# EAGLE design SparkFun_Si7021_Breakout (EAGLE 7.2.0)
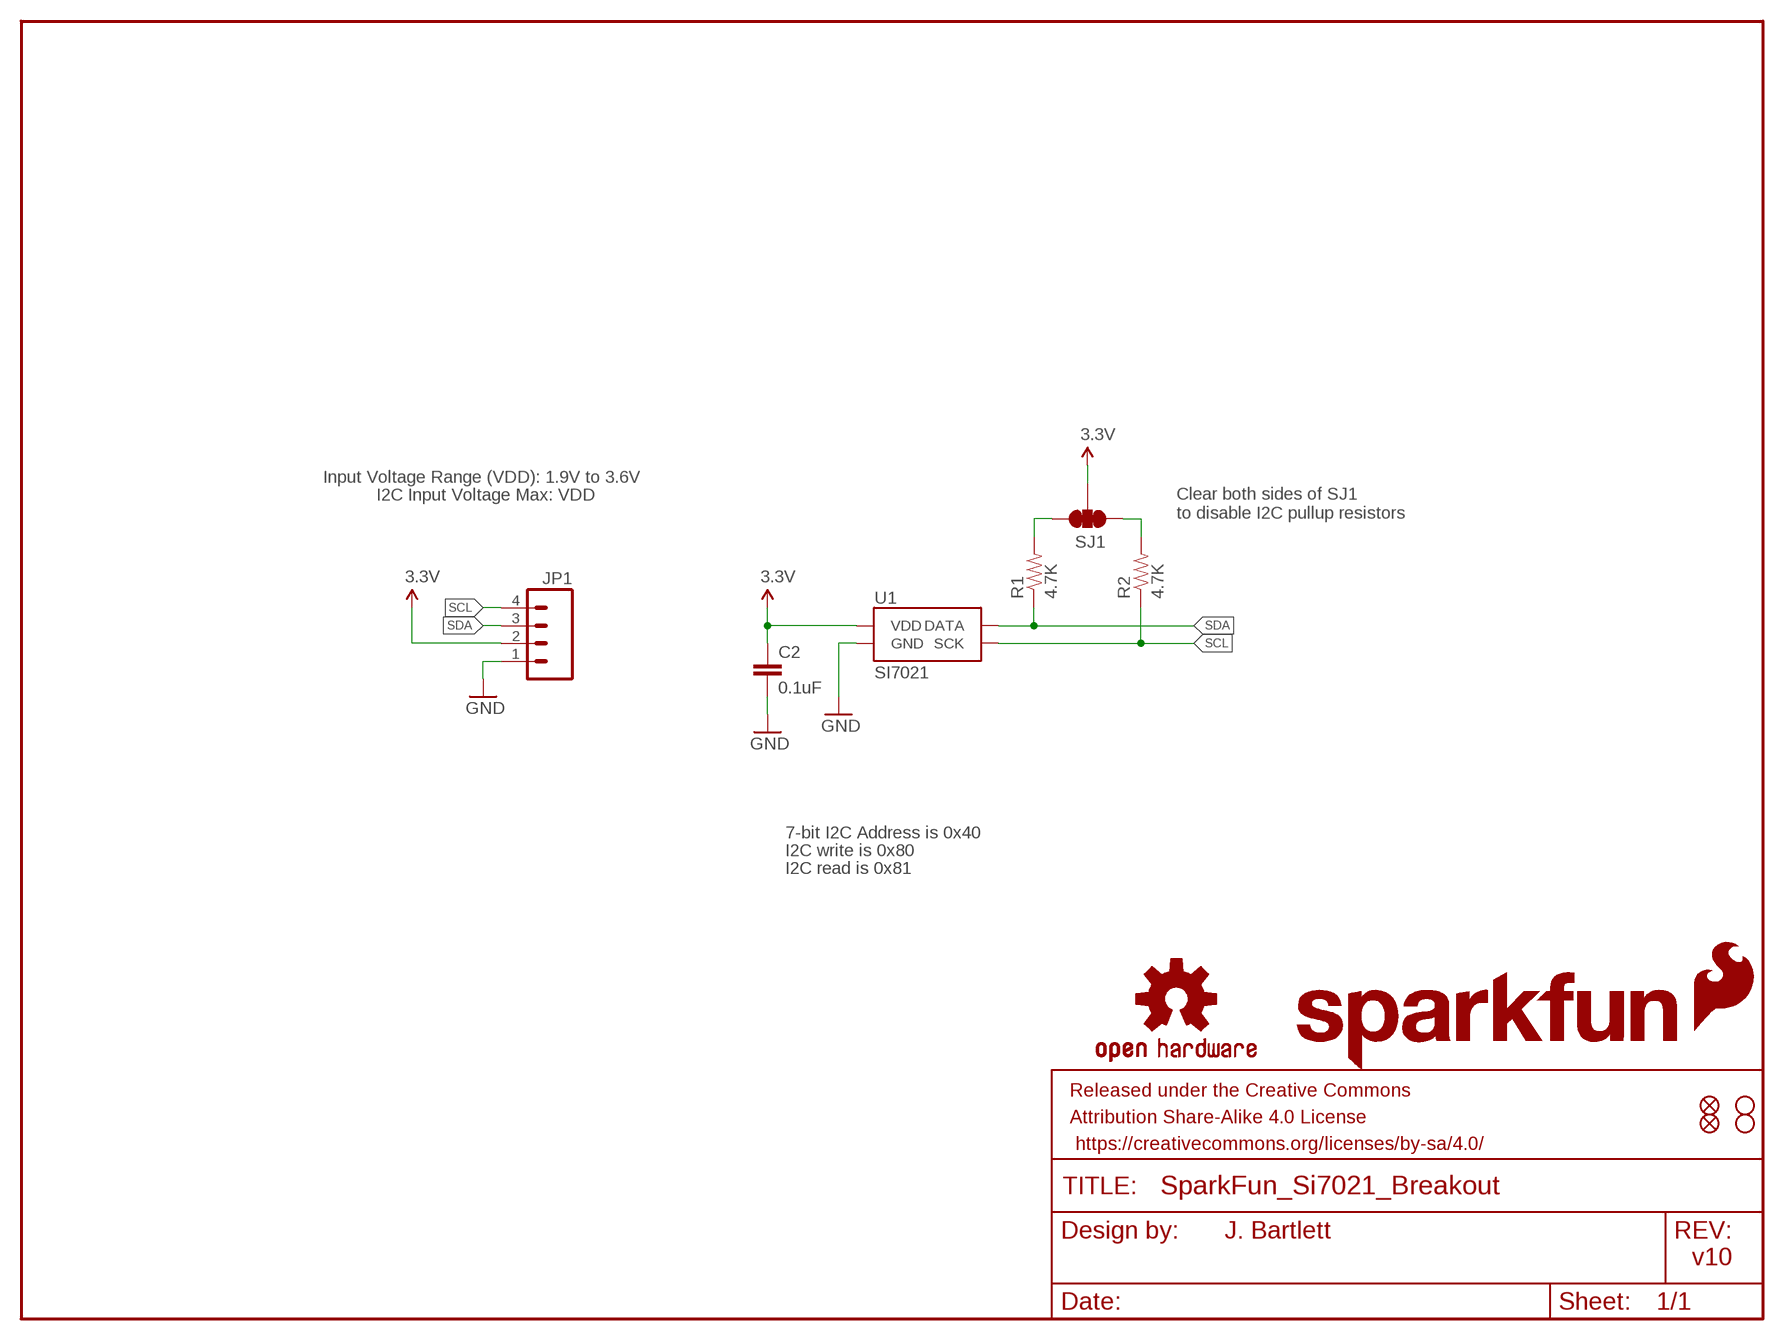
[diagram p0: schematic, sheet 1]

## Parts
C2  0.1uF  0.1UF-25V(+80/-20%)(0603)  [0603-CAP]
FRAME2  FRAME-LETTER  [CREATIVE_COMMONS]
JP1  M04PTH  [1X04]
JP3  FIDUCIALUFIDUCIAL  [MICRO-FIDUCIAL]
JP4  FIDUCIALUFIDUCIAL  [MICRO-FIDUCIAL]
LOGO2  OSHW-LOGOS  [OSHW-LOGO-S]
LOGO3  SFE_LOGO_FLAME.1_INCH  [SFE_LOGO_FLAME_.1]
LOGO4  SFE_LOGO_NAME.1_INCH  [SFE_LOGO_NAME_.1]
R1  4.7K  4.7KOHM-1/10W-1%(0603)  [0603-RES]
R2  4.7K  4.7KOHM-1/10W-1%(0603)  [0603-RES]
SJ1  SOLDERJUMPER_2WAYPASTE1&2&3  [SJ_3_PASTE1&2&3]
STANDOFF1  STAND-OFF  [STAND-OFF]
STANDOFF2  STAND-OFF  [STAND-OFF]
U1  SI7021  [SI7021]

## Nets
3.3V: C2.1 JP1.2 SJ1.2 U1.VDD
GND: C2.2 JP1.1 U1.GND
N$1: R1.2 SJ1.3
N$2: R2.2 SJ1.1
SCL: JP1.4 R2.1 U1.SCK
SDA: JP1.3 R1.1 U1.DATA

## Notes on the sheet
- Input Voltage Range (VDD): 1.9V to 3.6V
- I2C Input Voltage Max: VDD
- Clear both sides of SJ1
  to disable I2C pullup resistors
- 7-bit I2C Address is 0x40
- I2C write is 0x80
- I2C read is 0x81
- J. Bartlett
- v10

## Library data of the parts
C2 = SparkFun-Capacitors:0.1UF-25V(+80/-20%)(0603): CAP-00810 Ceramic Standard decoupling cap; PROD_ID: CAP-00810
FRAME2 = SparkFun-Aesthetics:FRAME-LETTER: Schematic Frame Standard 8.5x11 US Letter frame
JP1 = SparkFun-Connectors:M04: Header 4 Standard 4-pin 0.1" header. Use with straight break away headers (SKU : PRT-00116), right angle break away headers (PRT-00553), swiss pins (PRT-00743), machine pins (PRT-00117), and female headers (PRT-00115). Molex polarized connector foot print use with SKU : PRT-08231 with associated crimp pins and housings. 1MM SMD Version SKU: PRT-10208
JP3 JP4 = SparkFun-Aesthetics:FIDUCIAL: Fiducial Alignment Points Various fiducial points for machine vision alignment.
LOGO2 = SparkFun-Aesthetics:OSHW-LOGO: Open Source Hardware Logo This logo indicates the piece of hardware it is found on incorporates a OSHW license and/or adheres to the definition of open source hardware found here: http://freedomdefined.org/OSHW
LOGO3 = SparkFun-Aesthetics:SFE_LOGO_FLAME: SFE Logo, flame only This is the SparkFun flame logo. The logo on the schematic will always be the same size; the package variant is the height of the flame. Default layer for the logo on the board is tSilk.
LOGO4 = SparkFun-Aesthetics:SFE_LOGO_NAME: SFE Logo, name only This is the SparkFun name logo. The logo on the schematic will always be the same size; the package variant is the height of the flame part of the logo (or the height the flame would be, if it were drawn). Default layer for the logo on the board is tSilk.
R1 R2 = SparkFun-Resistors:4.7KOHM-1/10W-1%(0603): RES-07857; PROD_ID: RES-07857
SJ1 = mike-temp:SOLDERJUMPER_2WAY: Solder Jumper 2 way solder jumper
STANDOFF1 STANDOFF2 = SparkFun-Electromechanical:STAND-OFF: #4 Stand Off This is the mechanical footprint for a #4 phillips button head screw. Use the keepout ring to avoid running the screw head into surrounding components. SKU : PRT-00447
U1 = SparkFun-Sensors:SI7021: The Si7021 is an I2C Humidity and Temperature Sensor; PROD_ID: IC-13093

## Board
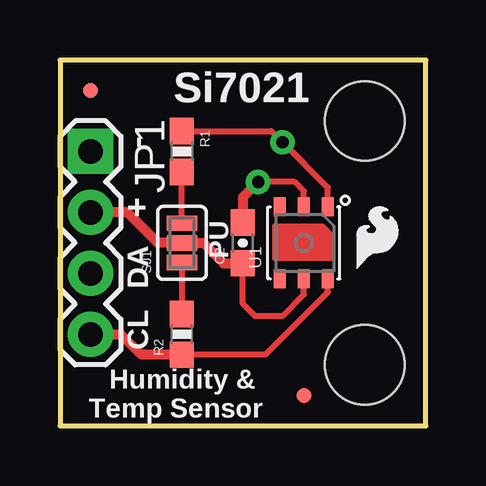
[diagram p1: board, top side]
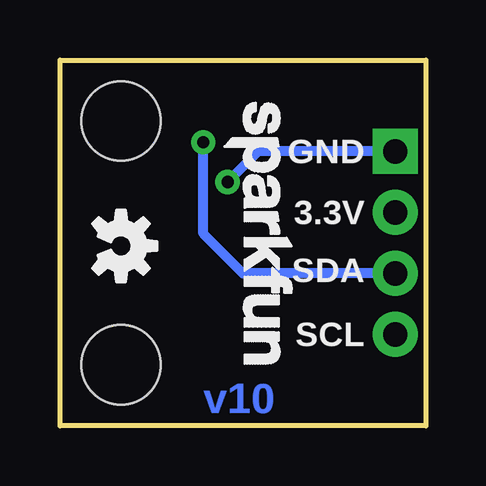
[diagram p2: board, bottom side, seen from below]

Size 15.24 x 15.24 mm. Coordinates in mm from the lower left corner, seen from the top.
Outline: 15.24,0 15.24,15.24 0,15.24 0,0 15.24,0
Copper layers (1*16): Top 0.035mm / dielectric 1.5mm / Bottom 0.035mm
Design rules "SparkFun": minimum track width 8mil, minimum drill 20mil, track to track 8mil, track to pad 8mil, pad to pad 8mil, via to via 8mil, smd to smd 8mil, copper to edge 10mil, drill to drill 8mil, minimum pad ring 12mil, minimum via ring 10mil, stop-mask expansion 4mil, vias tented up to drill 25mil, thermal gap 10mil

### Footprints (pad centres in the part's own frame; a part is rotated, then mirrored left to right if it is on the bottom)
0603-CAP = smd 1.1 x 1: 1 -0.85,0; 2 0.85,0
1X04 = drill 1.016 pad 1.88 square: 1 0,0 | drill 1.016 pad 1.88: 2 2.54,0; 3 5.08,0; 4 7.62,0
MICRO-FIDUCIAL = smd 0.635 x 0.635: 1 0,0
0603-RES = smd 1.1 x 1: 1 -0.85,0; 2 0.85,0
SJ_3_PASTE1&2&3 = smd 0.635 x 1.27: 1 -0.813,0; 2 0,0; 3 0.813,0
STAND-OFF = hole 3.302: 0,0
SI7021 = smd 0.8 x 0.5: DATA 1.5,-1; GND 1.5,0; NC@3 1.5,1; NC@4 -1.5,1; SCK -1.5,-1; VDD -1.5,0

### Placement (x,y rotation side)
C2  7.62,7.62 90 top
FRAME2  -12.7,-8.89 0 top  (outside the outline)
JP1  1.27,11.43 270 top
JP3  10.16,1.27 90 top
JP4  1.27,13.97 90 top
LOGO2  12.7,7.49 270 bottom
LOGO3  12.06,6.22 0 top
LOGO4  8.89,13.97 270 bottom
R1  5.08,11.43 270 top
R2  5.08,3.81 90 top
SJ1  5.08,7.62 90 top
STANDOFF1  12.7,12.7 90 top
STANDOFF2  12.7,2.54 90 top
U1  10.16,7.62 90 top

### Tracks (layer width: path | path; a pad name or v marks a point on that pad's centre or on a via)
3.3V
  Top 0.254: U1.VDD 10.16,5.46 9.27,4.57 8.13,4.57 7.62,5.08 C2.1
  Top 0.406: JP1.2 2.79,8.89 4.06,7.62 SJ1.2 5.97,7.62 6.82,6.77 C2.1
GND  (via drill 0.51)
  Top 0.254: U1.GND 10.16,9.78 9.78,10.16 v8.26,10.16
  Top 0.406: v8.26,10.16 7.62,9.53 C2.2
  Bottom 0.406: JP1.1 6.99,11.43 v8.26,10.16
N$1
  Top 0.254: SJ1.3 R1.2
N$2
  Top 0.254: SJ1.1 R2.2
SCL
  Top 0.254: U1.SCK 11.16,5.57 8.55,2.96 R2.1
  Top 0.406: JP1.4 2.54,3.81 3.39,2.96 R2.1
SDA  (via drill 0.51)
  Top 0.254: U1.DATA 11.16,9.92 v9.27,11.81 8.8,12.28 R1.1
  Bottom 0.406: JP1.3 7.62,6.35 9.27,8 v9.27,11.81

### Text on the board
Bottom: v10
tPlace: Si7021 | - | + | PU | DA | CL | Humidity & / Temp Sensor
bPlace: GND | 3.3V | SDA | SCL
tDocu: J. Bartlett